# Altium schematic sheet Power Supply for CPU Blocks.SchDoc
size 420 x 297 mm; SheetNumber: 20; SheetTotal: 26
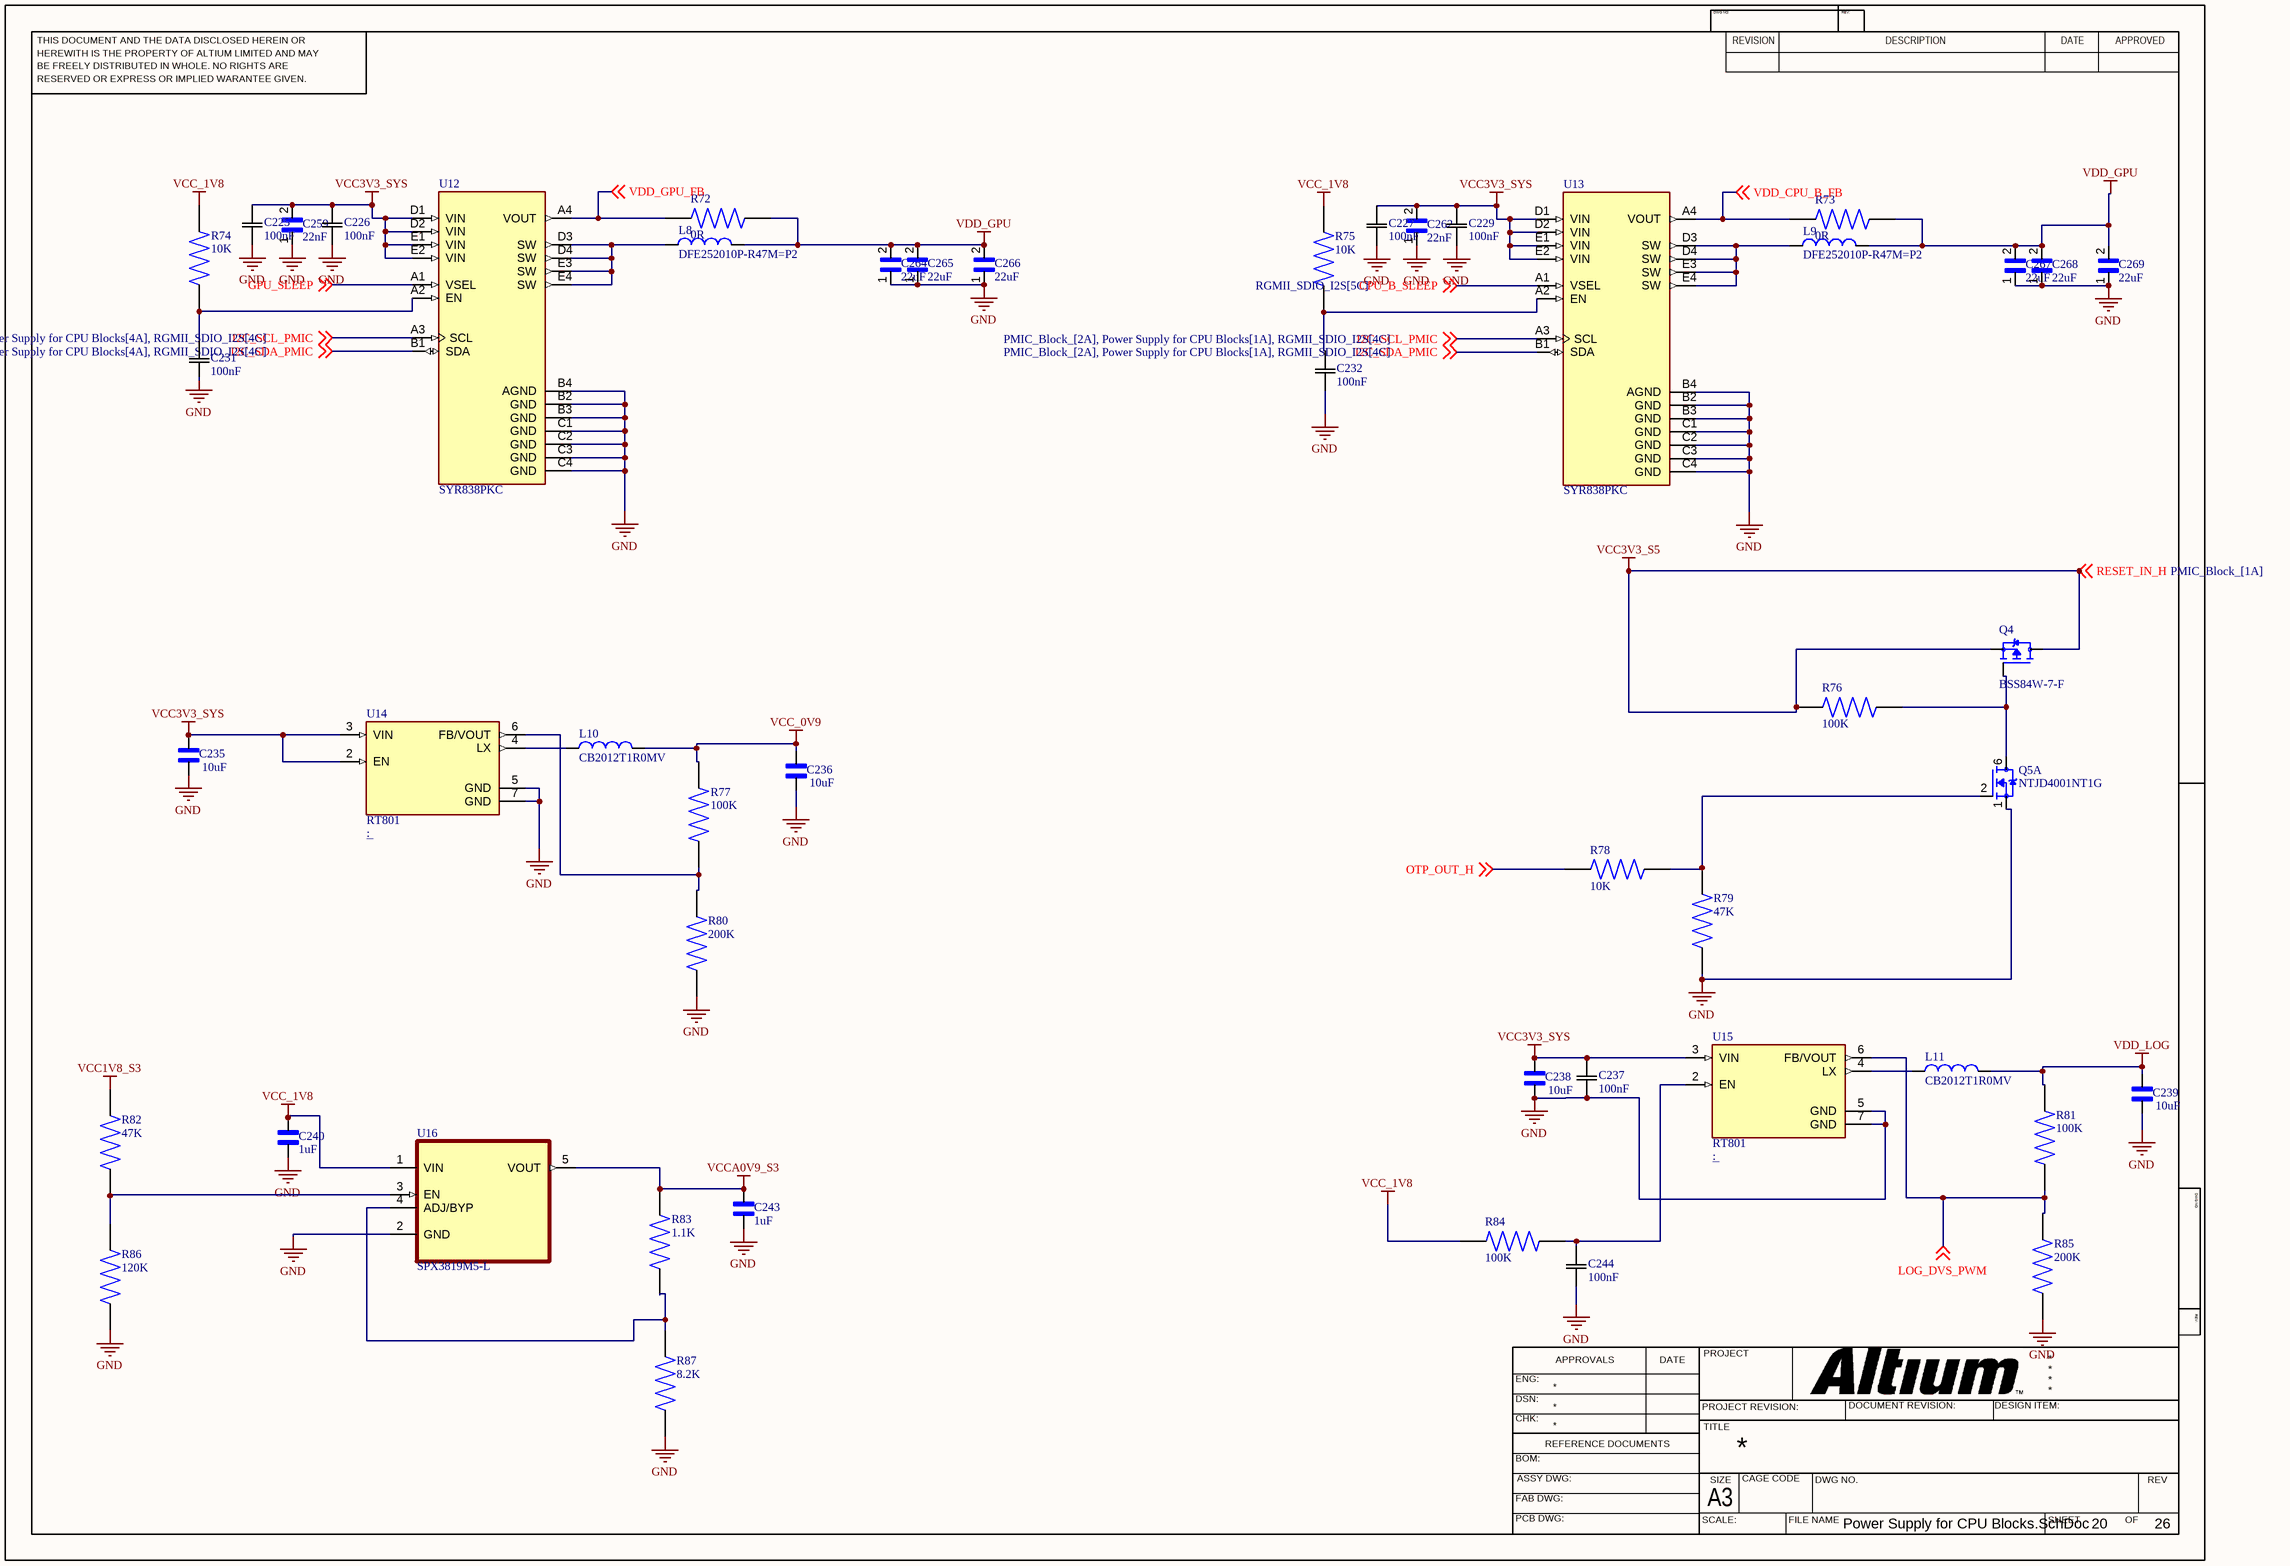
[diagram p0: Power Supply for CPU Blocks.SchDoc]

## Parts
C225  100nF  [CAP_1005_TDK]
C226  100nF  [CAP_1005_TDK]
C227  100nF  [CAP_1005_TDK]
C229  100nF  [CAP_1005_TDK]
C231  100nF  [CAP_1005_TDK]
C232  100nF  [CAP_1005_TDK]
C235  10uF  [CAPC1005X70N]
C236  10uF  [CAPC1005X70N]
C237  100nF  [CAP_1005_TDK]
C238  10uF  [CAPC1005X70N]
C239  10uF  [CAPC1005X70N]
C240  1uF  [CAPC1005X56N]
C243  1uF  [CAPC1005X56N]
C244  100nF  [CAP_1005_TDK]
C259  22nF  [CAPC6050X550N]
C262  22nF  [CAPC6050X550N]
C264  22uF  [CAPC6050X550N]
C265  22uF  [CAPC6050X550N]
C266  22uF  [CAPC6050X550N]
C267  22uF  [CAPC6050X550N]
C268  22uF  [CAPC6050X550N]
C269  22uF  [CAPC6050X550N]
L8  DFE252010P-R47M=P2  [INDC2520X100N]
L9  DFE252010P-R47M=P2  [INDC2520X100N]
L10  CB2012T1R0MV  [INDC2012X145N]
L11  CB2012T1R0MV  [INDC2012X145N]
Q4  BSS84W-7-F  [SOT65P222X110-3N]
Q5  NTJD4001NT1G  [SOT65P210X110-6N]  (part A of 2)
R72  0R  [RES_ERJH6G0R00V]
R73  0R  [RES_ERJH6G0R00V]
R74  10K  [RES_ERA3ARB103V]
R75  10K  [RES_ERA3ARB103V]
R76  100K  [RES_ERA3ARB103V]
R77  100K  [RES_ERA3ARB103V]
R78  10K  [RES_ERA3ARB103V]
R79  47K  [RES_ERA2ARC473X]
R80  200K  [RES_ERJP06D2003V]
R81  100K  [RES_ERA3ARB103V]
R82  47K  [RES_ERA2ARC473X]
R83  1.1K  [RESC1608X50N]
R84  100K  [RES_ERA3ARB103V]
R85  200K  [RES_ERJP06D2003V]
R86  120K  [RES_ERA8AEB124V]
R87  8.2K  [RES_ERA2APB822X]
U12  SYR838PKC  [BGA20N40P5X4_196X156X66N]
U13  SYR838PKC  [BGA20N40P5X4_196X156X66N]
U14  RT801  [SON65P200X200X80-7N]
U15  RT801  [SON65P200X200X80-7N]
U16  SPX3819M5-L  [SOT95P280X145-5N]

## Nets
GND: C225.1 C226.1 C227.1 C229.1 C231.1 C232.1 C235.1 C236.1 C237.1 C238.1 C239.1 C240.1 C243.1 C244.1 C259.1 C262.1 C264.1 C265.1 C266.1 C267.1 C268.1 C269.1 Q5.1(S1) R79.1 R80.1 R85.1 R86.1 R87.1 U12.B2(GND) U12.B3(GND) U12.B4(AGND) U12.C1(GND) U12.C2(GND) U12.C3(GND) U12.C4(GND) U13.B2(GND) U13.B3(GND) U13.B4(AGND) U13.C1(GND) U13.C2(GND) U13.C3(GND) U13.C4(GND) U14.5(GND) U14.7(GND) U15.5(GND) U15.7(GND) U16.2(GND)
VCC1V8_S3: R82.2
VCC3V3_S5: Q4.2(S) Q4.3(D) R76.2 ; off-sheet RESET_IN_H  [also labelled RESET_IN_H]
VCC3V3_SYS: C225.2 C226.2 C227.2 C229.2 C235.2 C237.2 C238.2 C259.2 C262.2 U12.D1(VIN) U12.D2(VIN) U12.E1(VIN) U12.E2(VIN) U13.D1(VIN) U13.D2(VIN) U13.E1(VIN) U13.E2(VIN) U14.2(EN) U14.3(VIN) U15.3(VIN)
VCC_0V9: C236.2 L10.2 R77.2
VCC_1V8: C240.2 R74.2 R75.2 R84.2 U16.1(VIN)
VCCA0V9_S3: C243.2 R83.2 U16.5(VOUT)
VDD_GPU: C264.2 C265.2 C266.2 C267.2 C268.2 C269.2 L8.2 L9.2 R72.2 R73.2
VDD_LOG: C239.2 L11.2 R81.2
CPU_B_SLEEP: U13.A1(VSEL) ; off-sheet CPU_B_SLEEP
GPU_SLEEP: U12.A1(VSEL) ; off-sheet GPU_SLEEP
I2C_SCL_PMIC: U12.A3(SCL) U13.A3(SCL) ; off-sheet I2C_SCL_PMIC
I2C_SDA_PMIC: U12.B1(SDA) U13.B1(SDA) ; off-sheet I2C_SDA_PMIC
LOG_DVS_PWM: R81.1 R85.2 U15.6(FB/VOUT) ; off-sheet LOG_DVS_PWM
OTP_OUT_H: R78.2 ; off-sheet OTP_OUT_H
VDD_CPU_B_FB: R73.1 U13.A4(VOUT) ; off-sheet VDD_CPU_B_FB
VDD_GPU_FB: R72.1 U12.A4(VOUT) ; off-sheet VDD_GPU_FB
NetC231_2: C231.2 R74.1 U12.A2(EN)
NetC232_2: C232.2 R75.1 U13.A2(EN)
NetC244_2: C244.2 R84.1 U15.2(EN)
NetL8_1: L8.1 U12.D3(SW) U12.D4(SW) U12.E3(SW) U12.E4(SW)
NetL9_1: L9.1 U13.D3(SW) U13.D4(SW) U13.E3(SW) U13.E4(SW)
NetL10_1: L10.1 U14.4(LX)
NetL11_1: L11.1 U15.4(LX)
NetQ4_1: Q4.1(G) Q5.6(D1) R76.1
NetQ5_2: Q5.2(G1) R78.1 R79.2
NetR77_1: R77.1 R80.2 U14.6(FB/VOUT)
NetR82_1: R82.1 R86.2 U16.3(EN)
NetR83_1: R83.1 R87.2 U16.4(ADJ/BYP)

## Notes on the sheet
- THIS DOCUMENT AND THE DATA DISCLOSED HEREIN OR
- HEREWITH IS THE PROPERTY OF ALTIUM LIMITED AND MAY
- DWG NO:
- REVISION
- REV:
- DESCRIPTION
- DATE
- APPROVED
- BE FREELY DISTRIBUTED IN WHOLE. NO RIGHTS ARE
- RESERVED OR EXPRESS OR IMPLIED WARANTEE GIVEN.
- ENG:
- APPROVALS
- PROJECT
- DSN:
- CHK:
- REFERENCE DOCUMENTS
- PROJECT REVISION:
- TITLE
- DOCUMENT REVISION:
- DESIGN ITEM:
- BOM:
- FAB DWG:
- PCB DWG:
- ASSY DWG:
- SCALE:
- A3
- SIZE
- CAGE CODE
- FILE NAME
- DWG NO.
- SHEET
- OF
- REV

## Library data of the parts
C225-C227 C229 C231 C232 C237 C244 = C1005X7R1H104M050BB: Description; Manufacturer_Name: TDK; Copyright: Copyright (C) 2025 Ultra Librarian. All rights reserved.; Manufacturer_Part_Number: C1005X7R1H104M050BB
C235 C236 C238 C239 = CL05A106MQ5NUNC: 10 ÂµF Â±20% 6.3V Ceramic Capacitor X5R 0402 (1005 Metric); MF: Samsung; SnapEDA_Link: https://www.snapeda.com/parts/CL05A106MQ5NUNC/Samsung/view-part/?ref=snap; Package: SMD-2 Samsung; Value: *; MP: CL05A106MQ5NUNC; Check_prices: https://www.snapeda.com/parts/CL05A106MQ5NUNC/Samsung/view-part/?ref=eda
C240 C243 = 0402ZD105KAT4A: 1 ÂµF Â±10% 10V Ceramic Capacitor X5R 0402 (1005 Metric); MF: AVX; SnapEDA_Link: https://www.snapeda.com/parts/0402ZD105KAT4A/AVX/view-part/?ref=snap; Package: 1005 AVX; Value: *; MP: 0402ZD105KAT4A; Check_prices: https://www.snapeda.com/parts/0402ZD105KAT4A/AVX/view-part/?ref=eda
C259 C262 C264-C269 = CKG57NX7S1H226M500JJ: 22ÂµF Â±20% 50V Ceramic Capacitor X7S Stacked SMD, 2 J-Lead; MP: CKG57NX7S1H226M500JJ; Package: None; Availability: Unavailable; Price: None; Value: *
L8 L9 = DFE252010P-R47M=P2: INDUCTOR, SHLD, 0.47UH, 20%, 4.1A, 1008; Package: None; Price: None; Value: *; MP: DFE252010P-R47M=P2; Availability: Unavailable
L10 L11 = CB2012T1R0MV: 1 ÂµH Unshielded Drum Core, Wirewound Inductor 700 mA 195mOhm Max 0805 (2012 Metric); MF: Taiyo Yuden; SnapEDA_Link: https://www.snapeda.com/parts/CB2012T1R0MV/Taiyo+Yuden/view-part/?ref=snap; Package: 2012 Taiyo Yuden; Value: *; MP: CB2012T1R0MV; Check_prices: https://www.snapeda.com/parts/CB2012T1R0MV/Taiyo+Yuden/view-part/?ref=eda
Q4 = BSS84W-7-F: P-Channel 50 V 130mA (Ta) 200mW (Ta) Surface Mount SOT-323; MF: Diodes Inc.; SnapEDA_Link: https://www.snapeda.com/parts/BSS84W-7-F/Diodes+Inc./view-part/?ref=snap; Availability: In Stock; Check_prices: https://www.snapeda.com/parts/BSS84W-7-F/Diodes+Inc./view-part/?ref=eda; MP: BSS84W-7-F; Price: None; Purchase-URL: https://pricing.snapeda.com/search/part/BSS84W-7-F/?ref=eda; Package: SOT-323 Diodes Inc.; Value: *
Q5 = NTJD4001NT1G: Mosfet Array 2 N-Channel (Dual) 30V 250mA 272mW Surface Mount SC-88/SC70-6/SOT-363; MF: ON Semiconductor; SnapEDA_Link: https://www.snapeda.com/parts/NTJD4001NT1G/Onsemi/view-part/?ref=snap; Package: SC-88-6 ON Semiconductor; Value: *; MP: NTJD4001NT1G; Check_prices: https://www.snapeda.com/parts/NTJD4001NT1G/Onsemi/view-part/?ref=eda
R72 R73 = ERJH6G0R00V: MP: ERJH6G0R00V; Value: *; Availability: Unavailable; Price: None; Package: None
R74-R78 R81 R84 = ERA3ARB103V: MP: ERA3ARB103V; Availability: Unavailable; Package: None; Value: *; Price: None
R79 R82 = ERA2ARC473X: Value: *; MP: ERA2ARC473X; Package: None; Availability: Unavailable; Price: None
R80 R85 = ERJP06D2003V: Package: None; Value: *; Price: None; MP: ERJP06D2003V; Availability: Unavailable
R83 = ERJP08F1101V: Package: None; Value: *; MP: ERJP08F1101V; Price: None; Availability: Unavailable
R86 = ERA8AEB124V: Availability: Unavailable; MP: ERA8AEB124V; Price: None; Package: None; Value: *
R87 = ERA2APB822X: Price: None; Value: *; Availability: Unavailable; Package: None; MP: ERA2APB822X
U12 U13 = SYR838PKC: MF: Silergy; SnapEDA_Link: https://www.snapeda.com/parts/SYR838PKC/Silergy/view-part/?ref=snap; Package: None; Value: *; MP: SYR838PKC; Check_prices: https://www.snapeda.com/parts/SYR838PKC/Silergy/view-part/?ref=eda
U14 U15 = RT8010GQW: Buck Switching Regulator IC Positive Adjustable 0.6V 1 Output 1A 6-WDFN Exposed Pad; MF: Richtek USA; SnapEDA_Link: https://www.snapeda.com/parts/RT8010GQW/Richtek%20USA%20Inc./view-part/641358/?ref=snap; Value: *; MP: RT8010GQW; Package: WDFN-6 Richtek
U16 = SPX3819M5-L: Linear Voltage Regulator IC Positive Adjustable 1 Output 500mA SOT-23-5; MF: MaxLinear, Inc.; MP: SPX3819M5-L/TR; SnapEDA_Link: https://www.snapeda.com/parts/SPX3819M5-L/TR/MaxLinear/view-part/?ref=snap; Package: SOT-23-5 Exar; Value: *; Check_prices: https://www.snapeda.com/parts/SPX3819M5-L/TR/MaxLinear/view-part/?ref=eda